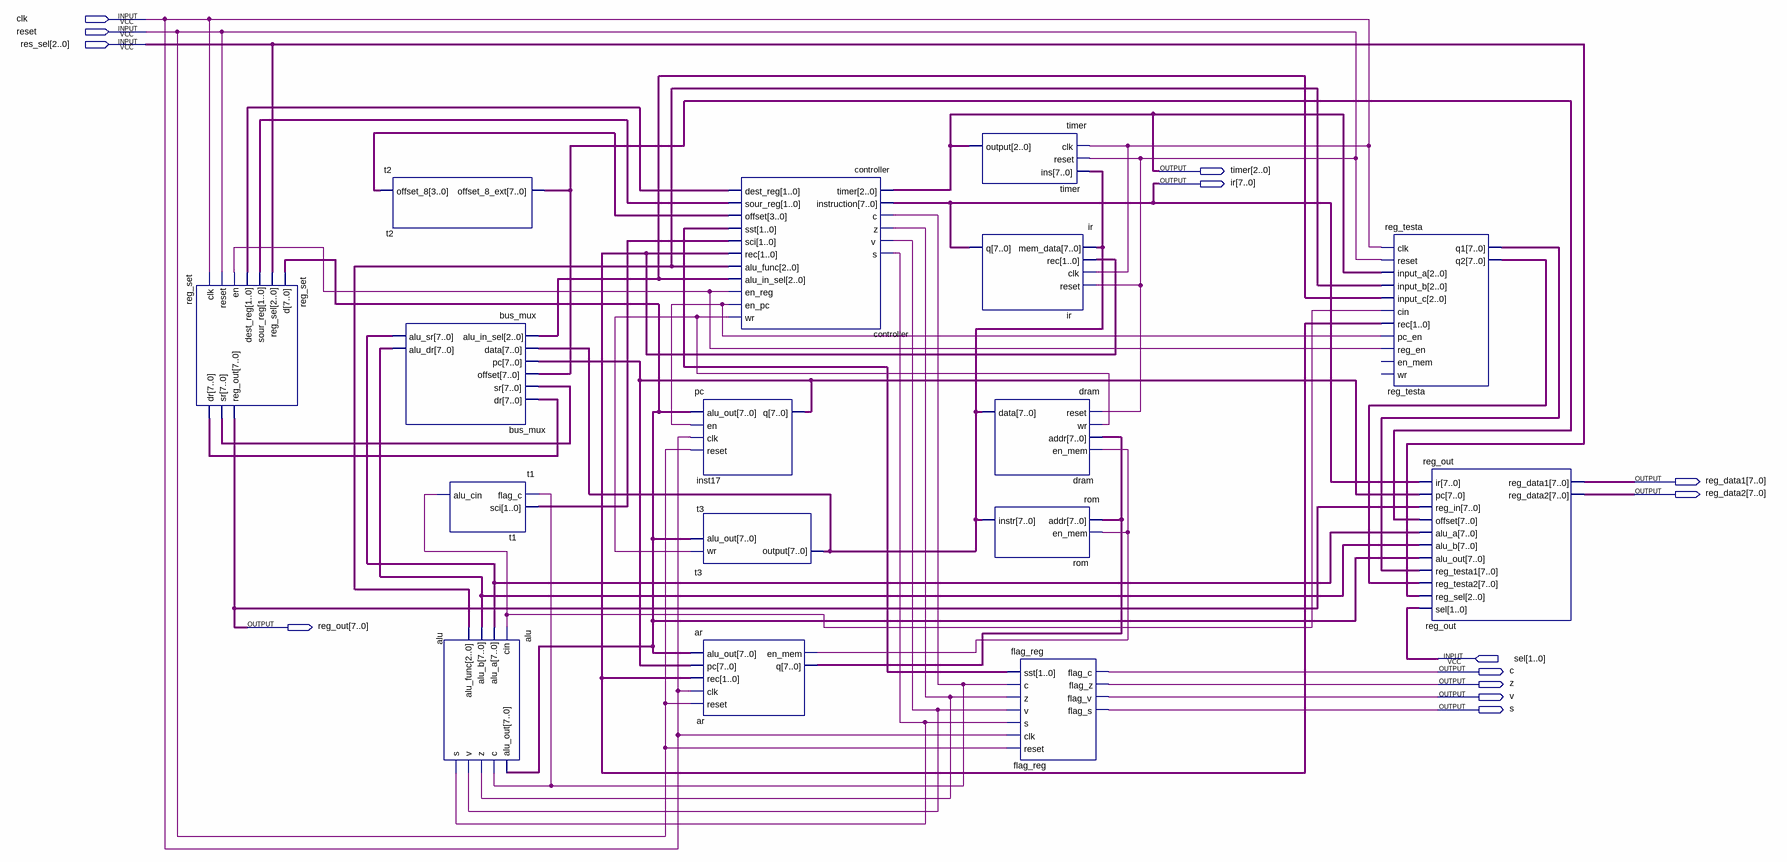
[diagram p0: schematic sheet]
// Quartus schematic cpu_8bit.bdf as structural Verilog: 16 symbols, 13 pins
module cpu_8bit (
  input  clk,
  input  reset,
  input  [2:0] res_sel,
  input  [1:0] sel,
  output [2:0] timer,
  output [7:0] ir,
  output [7:0] reg_data1,
  output [7:0] reg_data2,
  output [7:0] reg_out,
  output c,
  output z,
  output v,
  output s
);

  wire alu_c, alu_s, alu_v, alu_z, ar_en_mem, controller_en_pc, controller_en_reg, controller_wr, t1_alu_cin;
  wire [1:0] controller_dest_reg, controller_rec, controller_sci, controller_sour_reg, controller_sst;
  wire [2:0] controller_alu_func, controller_alu_in_sel;
  wire [3:0] controller_offset;
  wire [7:0] alu_alu_out, ar_q, bus_mux_alu_dr, bus_mux_alu_sr, inst17_q, reg_set_dr, reg_set_sr,
       reg_testa_q1, reg_testa_q2, t2_offset_8_ext, t3_output;

  reg_set reg_set (
    .clk(clk), .reset(reset), .en(controller_en_reg), .dest_reg(controller_dest_reg),
    .sour_reg(controller_sour_reg), .reg_sel(res_sel), .d(alu_alu_out), .dr(reg_set_dr), .sr(reg_set_sr),
    .reg_out(reg_out));
  t2 t2 (.offset_8(controller_offset), .offset_8_ext(t2_offset_8_ext));
  bus_mux bus_mux (
    .alu_in_sel(controller_alu_in_sel), .data(t3_output), .pc(inst17_q), .offset(t2_offset_8_ext),
    .sr(reg_set_sr), .dr(reg_set_dr), .alu_sr(bus_mux_alu_sr), .alu_dr(bus_mux_alu_dr));
  t1 t1 (.flag_c(alu_c), .sci(controller_sci), .alu_cin(t1_alu_cin));
  alu alu (
    .cin(t1_alu_cin), .alu_a(bus_mux_alu_sr), .alu_b(bus_mux_alu_dr), .alu_func(controller_alu_func),
    .alu_out(alu_alu_out), .c(alu_c), .z(alu_z), .v(alu_v), .s(alu_s));
  pc inst17 (.alu_out(alu_alu_out), .en(controller_en_pc), .clk(clk), .reset(reset), .q(inst17_q));
  t3 t3 (.wr(controller_wr), .alu_out(alu_alu_out), .\output (t3_output));
  ar ar (
    .alu_out(alu_alu_out), .pc(inst17_q), .rec(controller_rec), .clk(clk), .reset(reset), .en_mem(ar_en_mem),
    .q(ar_q));
  controller controller (
    .timer(timer), .instruction(ir), .c(alu_c), .z(alu_z), .v(alu_v), .s(alu_s),
    .dest_reg(controller_dest_reg), .sour_reg(controller_sour_reg), .offset(controller_offset),
    .sst(controller_sst), .sci(controller_sci), .rec(controller_rec), .alu_func(controller_alu_func),
    .alu_in_sel(controller_alu_in_sel), .en_reg(controller_en_reg), .en_pc(controller_en_pc),
    .wr(controller_wr));
  timer u_timer (.clk(clk), .reset(reset), .ins(t3_output), .\output (timer));
  ir u_ir (.mem_data(t3_output), .rec(controller_rec), .clk(clk), .reset(reset), .q(ir));
  dram dram (.reset(reset), .wr(controller_wr), .addr(ar_q), .en_mem(ar_en_mem), .data(t3_output));
  rom rom (.addr(ar_q), .en_mem(ar_en_mem), .instr(t3_output));
  flag_reg flag_reg (
    .sst(controller_sst), .c(alu_c), .z(alu_z), .v(alu_v), .s(alu_s), .clk(clk), .reset(reset), .flag_c(c),
    .flag_z(z), .flag_v(v), .flag_s(s));
  reg_testa reg_testa (
    .clk(clk), .reset(reset), .input_a(timer), .input_b(controller_alu_func),
    .input_c(controller_alu_in_sel), .cin(t1_alu_cin), .rec(controller_rec), .pc_en(controller_en_pc),
    .reg_en(controller_en_reg), .q1(reg_testa_q1), .q2(reg_testa_q2));  // open: en_mem, wr
  reg_out u_reg_out (
    .ir(ir), .pc(inst17_q), .reg_in(reg_out), .offset(t2_offset_8_ext), .alu_a(bus_mux_alu_sr),
    .alu_b(bus_mux_alu_dr), .alu_out(alu_alu_out), .reg_testa1(reg_testa_q1), .reg_testa2(reg_testa_q2),
    .reg_sel(res_sel), .sel(sel), .reg_data1(reg_data1), .reg_data2(reg_data2));
endmodule
